# EAGLE schematic brain_rev_2 (EAGLE 6.3)
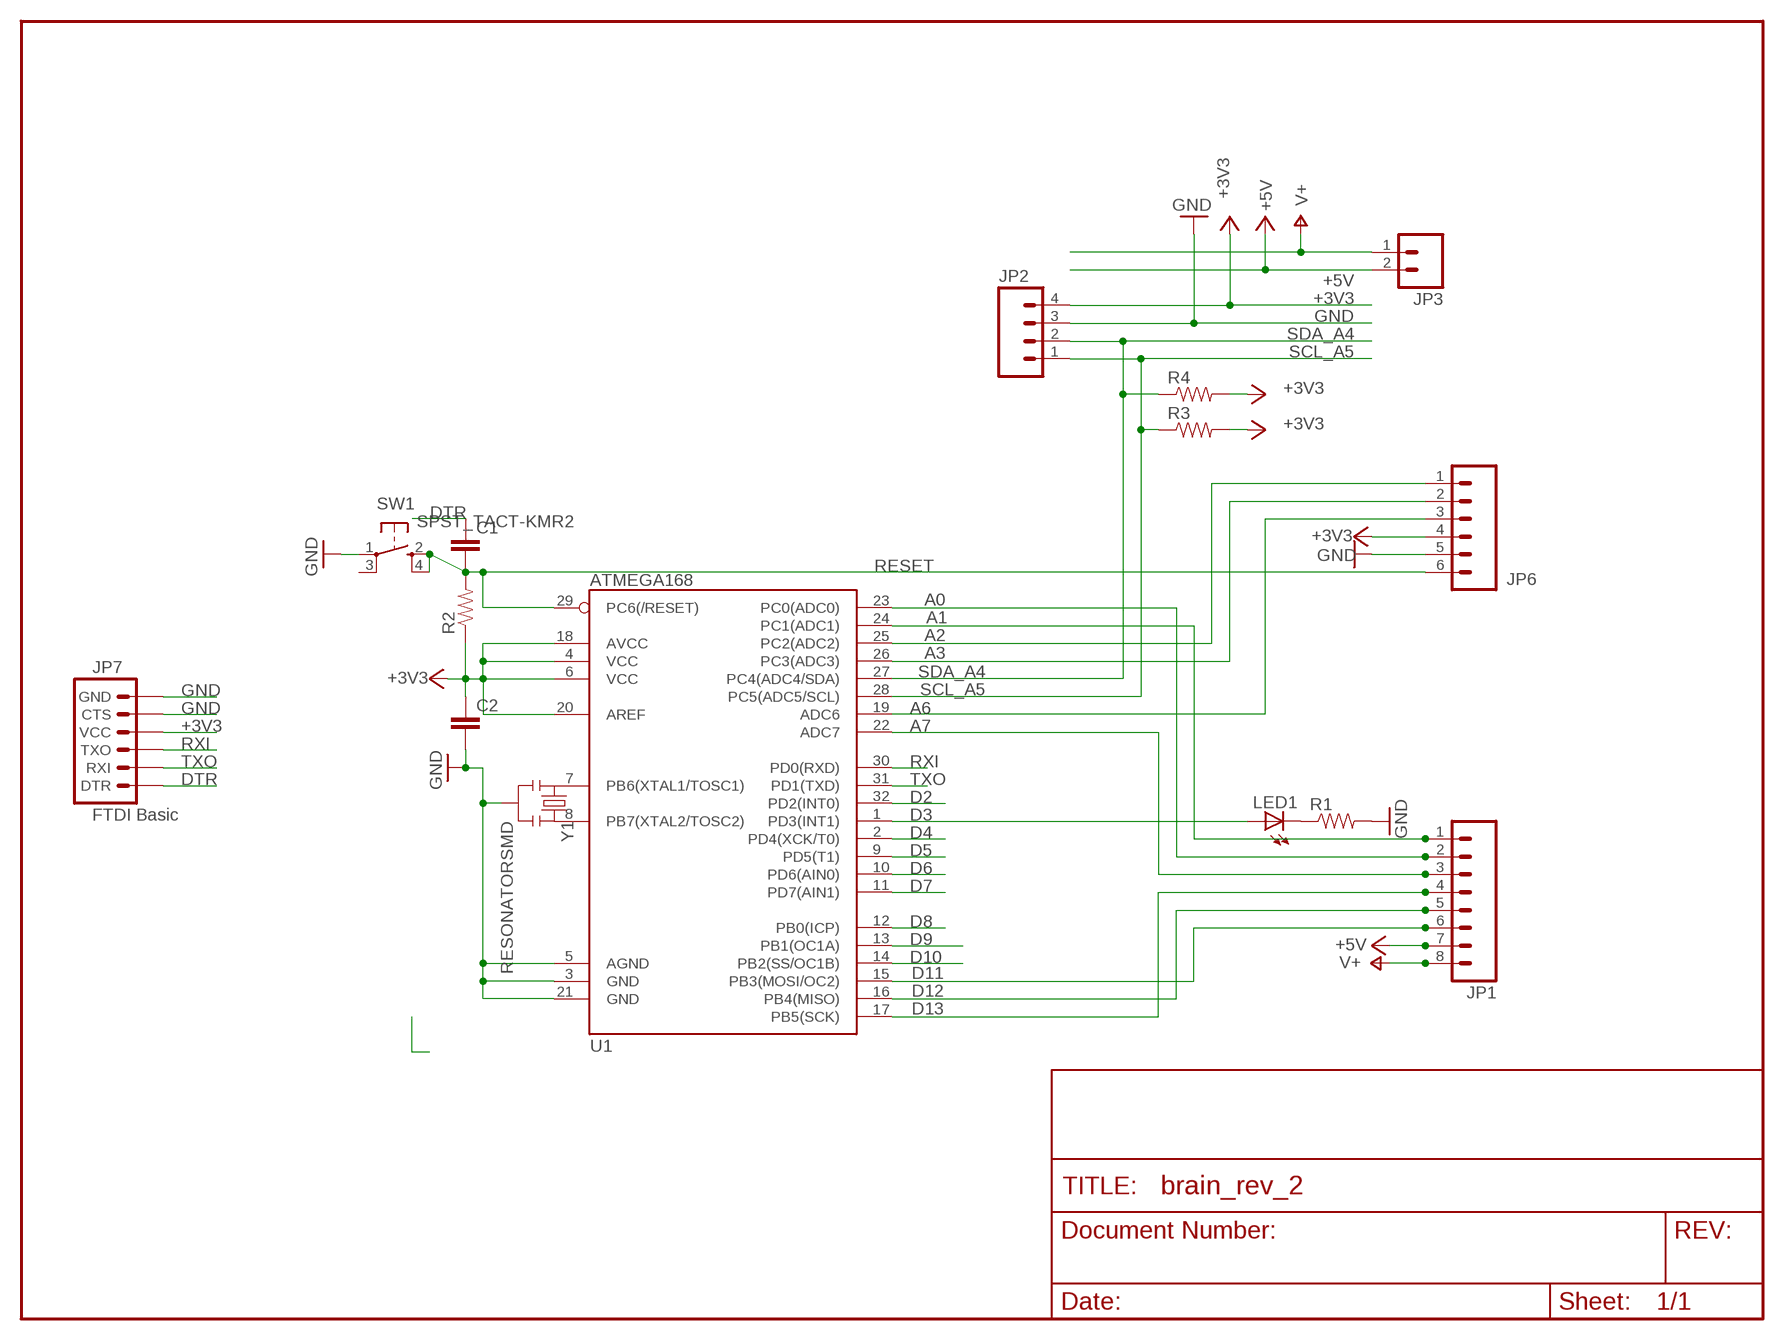
[diagram p0: schematic, sheet 1]

## Parts
C1  CAP1206  [1206]
C2  CAP1206  [1206]
JP1  M081X08  [1X08]
JP2  M04PTH  [1X04]
JP3  M02PTH  [1X02]
JP6  M06SIP  [1X06]
JP7  FTDI Basic  ARDUINO_SERIAL_PROGRAMPTH  [1X06]
LED1  LEDCHIPLED_1206  [CHIPLED_1206]
R1  RESISTOR1206  [1206]
R2  RESISTOR1206  [1206]
R3  RESISTOR1206  [1206]
R4  RESISTOR1206  [1206]
SW1  SPST_TACT-KMR2  [KMR2]
U1  ATMEGA168  [TQFP32-08]
Y1  RESONATORSMD  [RESONATOR-SMD]

## Nets
+3V3: C2.1 JP2.4 JP6.4 JP7.4(VCC) R2.1 R3.2 R4.2 U1.4(VCC) U1.6(VCC) U1.18(AVCC) U1.20(AREF)
+5V: JP1.7 JP3.2
A0: JP1.2 U1.23(PC0(ADC0))
A1: JP1.1 U1.24(PC1(ADC1))
A2: JP6.1 U1.25(PC2(ADC2))
A3: JP6.2 U1.26(PC3(ADC3))
A6: JP6.3 U1.19(ADC6)
A7: JP1.3 U1.22(ADC7)
D2: U1.32(PD2(INT0))
D3: LED1.A U1.1(PD3(INT1))
D4: U1.2(PD4(XCK/T0))
D5: U1.9(PD5(T1))
D6: U1.10(PD6(AIN0))
D7: U1.11(PD7(AIN1))
D8: U1.12(PB0(ICP))
D9: U1.13(PB1(OC1A))
D10: U1.14(PB2(SS/OC1B))
D11: JP1.6 U1.15(PB3(MOSI/OC2))
D12: JP1.5 U1.16(PB4(MISO))
D13: JP1.4 U1.17(PB5(SCK))
DTR: C1.1 JP7.1(DTR)
GND: C2.2 JP2.3 JP6.5 JP7.5(CTS) JP7.6(GND) R1.2 SW1.1(P) U1.3(GND) U1.5(AGND) U1.21(GND) Y1.2
N$1: U1.8(PB7(XTAL2/TOSC2)) Y1.3
N$3: U1.7(PB6(XTAL1/TOSC1)) Y1.1
N$4: LED1.C R1.1
RESET: C1.2 JP6.6 R2.2 SW1.2(S) SW1.4(S1) U1.29(PC6(/RESET))
RXI: JP7.3(TXO) U1.30(PD0(RXD))
SCL_A5: JP2.1 R3.1 U1.28(PC5(ADC5/SCL))
SDA_A4: JP2.2 R4.1 U1.27(PC4(ADC4/SDA))
TXO: JP7.2(RXI) U1.31(PD1(TXD))
V+: JP1.8 JP3.1
Unconnected: SW1.3(P1)

## Library data of the parts
C1 C2 = SparkFun:CAP: Capacitor Standard 0603 ceramic capacitor, and 0.1" leaded capacitor.
JP1 = SparkFun:M08: Header 8 Standard 8-pin 0.1" header. Use with straight break away headers (SKU : PRT-00116), right angle break away headers (PRT-00553), swiss pins (PRT-00743), machine pins (PRT-00117), and female headers (PRT-00115).
JP2 = SparkFun_mod:M04: Header 4 Standard 4-pin 0.1" header. Use with straight break away headers (SKU : PRT-00116), right angle break away headers (PRT-00553), swiss pins (PRT-00743), machine pins (PRT-00117), and female headers (PRT-00115). Molex polarized connector foot print use with SKU : PRT-08231 with associated crimp pins and housings. 1MM SMD Version SKU: PRT-10208
JP3 = SparkFun_mod:M02: Header 2 Standard 2-pin 0.1" header. Use with straight break away headers (SKU : PRT-00116), right angle break away headers (PRT-00553), swiss pins (PRT-00743), machine pins (PRT-00117), and female headers (PRT-00115). Molex polarized connector foot print use with SKU : PRT-08233 with associated crimp pins and housings.
JP6 = SparkFun:M06: Header 6 Standard 6-pin 0.1" header. Use with straight break away headers (SKU : PRT-00116), right angle break away headers (PRT-00553), swiss pins (PRT-00743), machine pins (PRT-00117), and female headers (PRT-00115). Molex polarized connector foot print use with SKU : PRT-08094 with associated crimp pins and housings. NOTES ON THE VARIANTS LOCK and LOCK_LONGPADS... This footprint was designed to help hold the alignment of a through-hole component (i.e. 6-pin header) while soldering it into place. You may notice that each hole has been shifted either up or down by 0.005 of an inch from it's more standard position (which is a perfectly straight line). This slight alteration caused the pins (the squares in the middle) to touch the edges of the holes. Because they are alternating, it causes a "brace" to hold the component in place. 0.005 has proven to be the perfect amount of "off-center" position when using our standard breakaway headers. Although looks a little odd when you look at the bare footprint, once you have a header in there, the alteration is very hard to notice. Also, if you push a header all the way into place, it is covered up entirely on the bottom side. This idea of altering the position of holes to aid alignment will be further integrated into the Sparkfun Library for other footprints. It can help hold any component with 3 or more connection pins.
JP7 = SparkFun:ARDUINO_SERIAL_PROGRAM
LED1 = adafruit:LED: LED OSRAM: - CHIPLED LG R971, LG N971, LY N971, LG Q971, LY Q971, LO R971, LY R971 LH N974, LH R974 LS Q976, LO Q976, LY Q976 LO Q996 - Hyper CHIPLED LW Q18S LB Q993, LB Q99A, LB R99A - SideLED LS A670, LO A670, LY A670, LG A670, LP A670 LB A673, LV A673, LT A673, LW A673 LH A674 LY A675 LS A676, LA A676, LO A676, LY A676, LW A676 LS A679, LY A679, LG A679 - Hyper Micro SIDELED® LS Y876, LA Y876, LO Y876, LY Y876 LT Y87S - SmartLED LW L88C, LW L88S LB L89C, LB L89S, LG L890 LS L89K, LO L89K, LY L89K LS L896, LA L896, LO L896, LY L896 - TOPLED LS T670, LO T670, LY T670, LG T670, LP T670 LSG T670, LSP T670, LSY T670, LOP T670, LYG T670 LG T671, LOG T671, LSG T671 LB T673, LV T673, LT T673, LW T673 LH T674 LS T676, LA T676, LO T676, LY T676, LB T676, LH T676, LSB T676, LW T676 LB T67C, LV T67C, LT T67C, LS T67K, LO T67K, LY T67K, LW E67C LS E67B, LA E67B, LO E67B, LY E67B, LB E67C, LV E67C, LT E67C LW T67C LS T679, LY T679, LG T679 LS T770, LO T770, LY T770, LG T770, LP T770 LB T773, LV T773, LT T773, LW T773 LH T774 LS E675, LA E675, LY E675, LS T675 LS T776, LA T776, LO T776, LY T776, LB T776 LHGB T686 LT T68C, LB T68C - Hyper Mini TOPLED® LB M676 - Mini TOPLED Santana® LG M470 LS M47K, LO M47K, LY M47K Source: http://www.osram.convergy.de/
R1-R4 = SparkFun:RESISTOR: Resistor Basic schematic elements and footprints for 0603, 1206, and PTH resistors.
SW1 = adafruit:SPST_TACT: SMT 6mm switch, EVQQ2 series http://www.ladyada.net/library/eagle
U1 = SparkFun:ATMEGA168
Y1 = SparkFun:RESONATOR: Resonator Small SMD resonator. This is the itty bitty 10/20MHz resonators with built in caps. CSTCE10M0G55 and CSTCE20M0V53. Footprint has been reviewed closely but hasn't been tested yet.

## Net classes
0 default: width 0.203 mm
1 vcc: width 0.254 mm